# EAGLE schematic circuitPendulumBrushes (EAGLE 6.6.0)
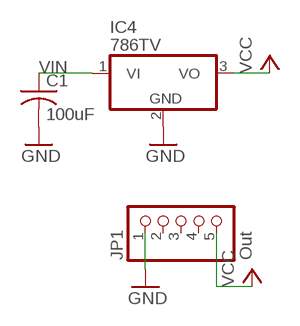
[diagram p0: schematic, sheet 1]

## Parts
C1  100uF  C-US050-045X075  [C050-045X075]
IC4  786TV  [TO220V]
JP1  Out  PINHD-1X55X2MM  [1_05X2MM]

## Nets
GND: C1.2 IC4.2(GND) JP1.1
VCC: IC4.3(VO) JP1.5
VIN: C1.1 IC4.1(VI)
Unconnected: JP1.2 JP1.3 JP1.4

## Library data of the parts
C1 = rcl:C-US: CAPACITOR, American symbol
IC4 = linear:78*: Positive VOLTAGE REGULATOR Source: http://cache.national.com/ds/LM/LM78L05.pdf http://www.fairchildsemi.com/ds/LM/LM7805.pdf
JP1 = pinhead:PINHD-1X5: PIN HEADER